# Altium schematic sheet TUNDRA.SchDoc: Tundra Drone Hovedkart
size A4; Date: 31.12.2020.; DrawnBy: Sigmoid DOO Novi Sad, Serbia; DocumentNumber: 1/4; SheetNumber: 1; SheetTotal: 4
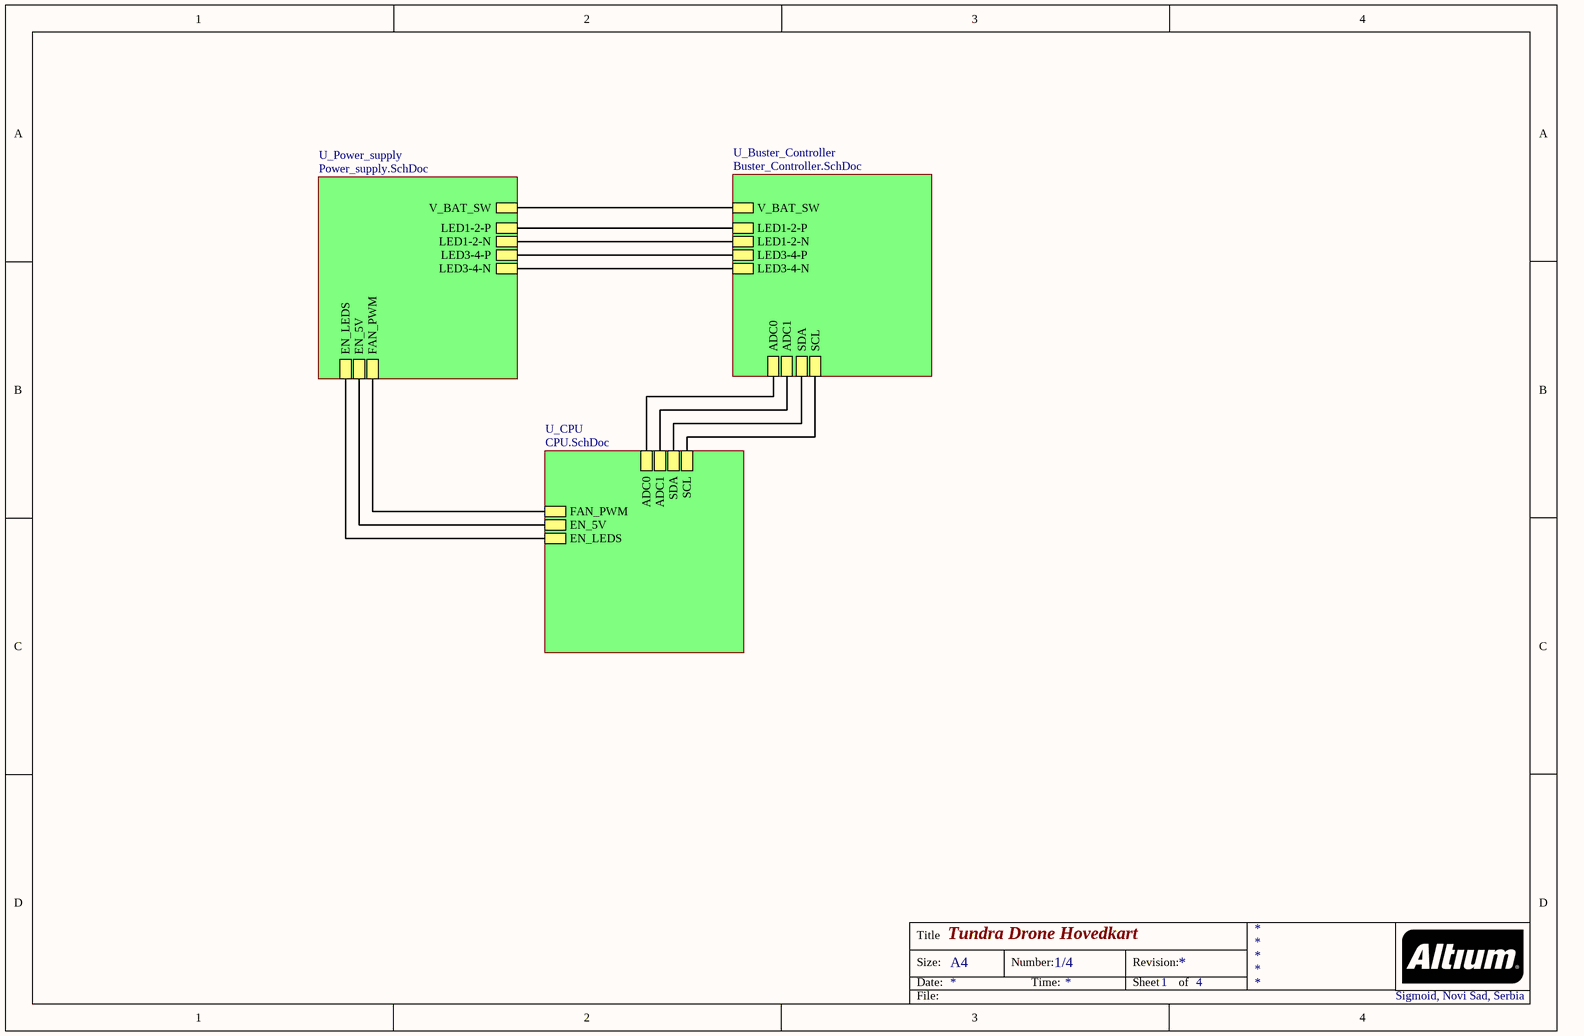
[diagram p0: TUNDRA.SchDoc]

## Sub-sheets
U_Buster_Controller = Buster_Controller.SchDoc: V_BAT_SW, LED3-4-N, ADC0, ADC1, LED1-2-N, LED1-2-P, LED3-4-P, SDA, SCL
U_CPU = CPU.SchDoc: EN_5V, EN_LEDS, FAN_PWM, ADC0, ADC1, SDA, SCL
U_Power_supply = Power_supply.SchDoc: V_BAT_SW, EN_LEDS, EN_5V, FAN_PWM, LED1-2-P, LED1-2-N, LED3-4-P, LED3-4-N

## Nets
(unnamed): sheet U_Buster_Controller/V_BAT_SW, sheet U_Power_supply/V_BAT_SW
(unnamed): sheet U_Buster_Controller/LED3-4-N, sheet U_Power_supply/LED3-4-N
(unnamed): sheet U_Buster_Controller/ADC0, sheet U_CPU/ADC0
(unnamed): sheet U_Buster_Controller/ADC1, sheet U_CPU/ADC1
(unnamed): sheet U_Buster_Controller/LED1-2-N, sheet U_Power_supply/LED1-2-N
(unnamed): sheet U_Buster_Controller/LED1-2-P, sheet U_Power_supply/LED1-2-P
(unnamed): sheet U_Buster_Controller/LED3-4-P, sheet U_Power_supply/LED3-4-P
(unnamed): sheet U_Buster_Controller/SDA, sheet U_CPU/SDA
(unnamed): sheet U_Buster_Controller/SCL, sheet U_CPU/SCL
(unnamed): sheet U_CPU/EN_5V, sheet U_Power_supply/EN_5V
(unnamed): sheet U_CPU/EN_LEDS, sheet U_Power_supply/EN_LEDS
(unnamed): sheet U_CPU/FAN_PWM, sheet U_Power_supply/FAN_PWM

## Notes on the sheet
- Sigmoid, Novi Sad, Serbia
- Title
- Size:
- Date:
- A4
- Number:
- Time:
- Revision:
- Sheet
- of
- File: